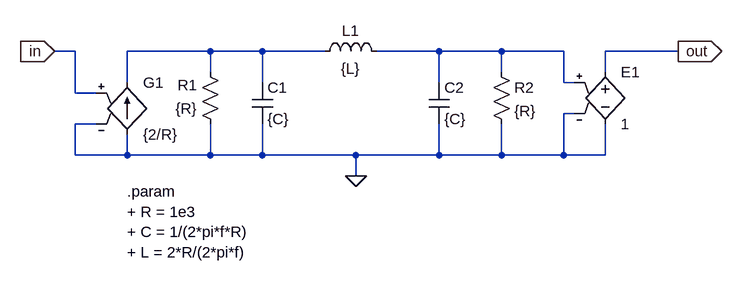
[diagram p0: schematic ButterwLPF_3th.asc]
ButterwLPF_3th.asc, the LTspice schematic file:
Version 4
SHEET 1 880 680
WIRE -160 -48 -192 -48
WIRE -160 16 -160 -48
WIRE -160 112 -160 64
WIRE -128 16 -160 16
WIRE -128 64 -160 64
WIRE -80 0 -80 -48
WIRE -80 112 -160 112
WIRE -80 112 -80 80
WIRE 48 -48 -80 -48
WIRE 48 -16 48 -48
WIRE 48 112 -80 112
WIRE 48 112 48 64
WIRE 128 -48 48 -48
WIRE 128 0 128 -48
WIRE 128 112 48 112
WIRE 128 112 128 64
WIRE 224 -48 128 -48
WIRE 272 112 128 112
WIRE 272 144 272 112
WIRE 400 -48 304 -48
WIRE 400 0 400 -48
WIRE 400 112 272 112
WIRE 400 112 400 64
WIRE 496 -48 400 -48
WIRE 496 -16 496 -48
WIRE 496 112 400 112
WIRE 496 112 496 64
WIRE 592 -48 496 -48
WIRE 592 0 592 -48
WIRE 592 112 496 112
WIRE 592 112 592 48
WIRE 608 0 592 0
WIRE 608 48 592 48
WIRE 656 -16 656 -48
WIRE 656 112 592 112
WIRE 656 112 656 64
WIRE 768 -48 656 -48
FLAG 272 144 0
FLAG -192 -48 in
IOPIN -192 -48 In
FLAG 768 -48 out
IOPIN 768 -48 Out
SYMBOL res 64 80 R180
WINDOW 0 36 76 Left 0
WINDOW 3 36 40 Left 0
SYMATTR InstName R1
SYMATTR Value {R}
SYMBOL res 480 -32 R0
SYMATTR InstName R2
SYMATTR Value {R}
SYMBOL cap 112 0 R0
SYMATTR InstName C1
SYMATTR Value {C}
SYMBOL cap 384 0 R0
SYMATTR InstName C2
SYMATTR Value {C}
SYMBOL ind 208 -32 R270
WINDOW 0 32 56 VTop 0
WINDOW 3 5 56 VBottom 0
SYMATTR InstName L1
SYMATTR Value {L}
SYMBOL g -80 -16 R0
SYMATTR InstName G1
SYMATTR Value {2/R}
SYMBOL e 656 -32 R0
SYMATTR InstName E1
SYMATTR Value 1
TEXT -80 168 Left 0 !.param\n+ R = 1e3\n+ C = 1/(2*pi*f*R)\n+ L = 2*R/(2*pi*f)

The netlist it stands for:
* ButterwLPF_3th.asc
R1 0 N001 {R}
R2 N002 0 {R}
C1 N001 0 {C}
C2 N002 0 {C}
L1 N001 N002 {L}
G1 0 N001 in 0 {2/R}
E1 out 0 N002 0 1
.param
+ R = 1e3
+ C = 1/(2*pi*f*R)
+ L = 2*R/(2*pi*f)
.backanno
.end